# Altium schematic sheet 001_top.SchDoc
size A2; Organization: Greenfield Tech Solutions; Address1: Molendreef 33; Address2: Ossendrecht; Address3: 4641CS; Address4: The Netherlands; SheetNumber: 1; SheetTotal: 7
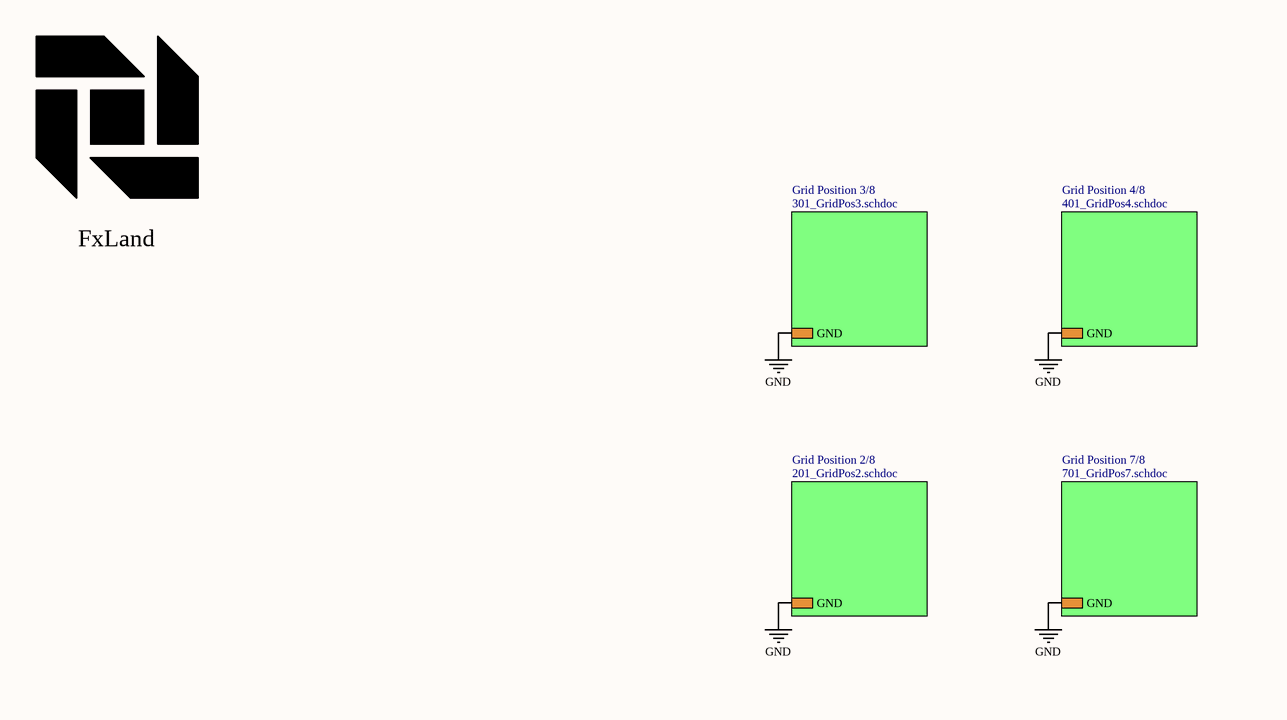
[diagram p0: 001_top.SchDoc, left]
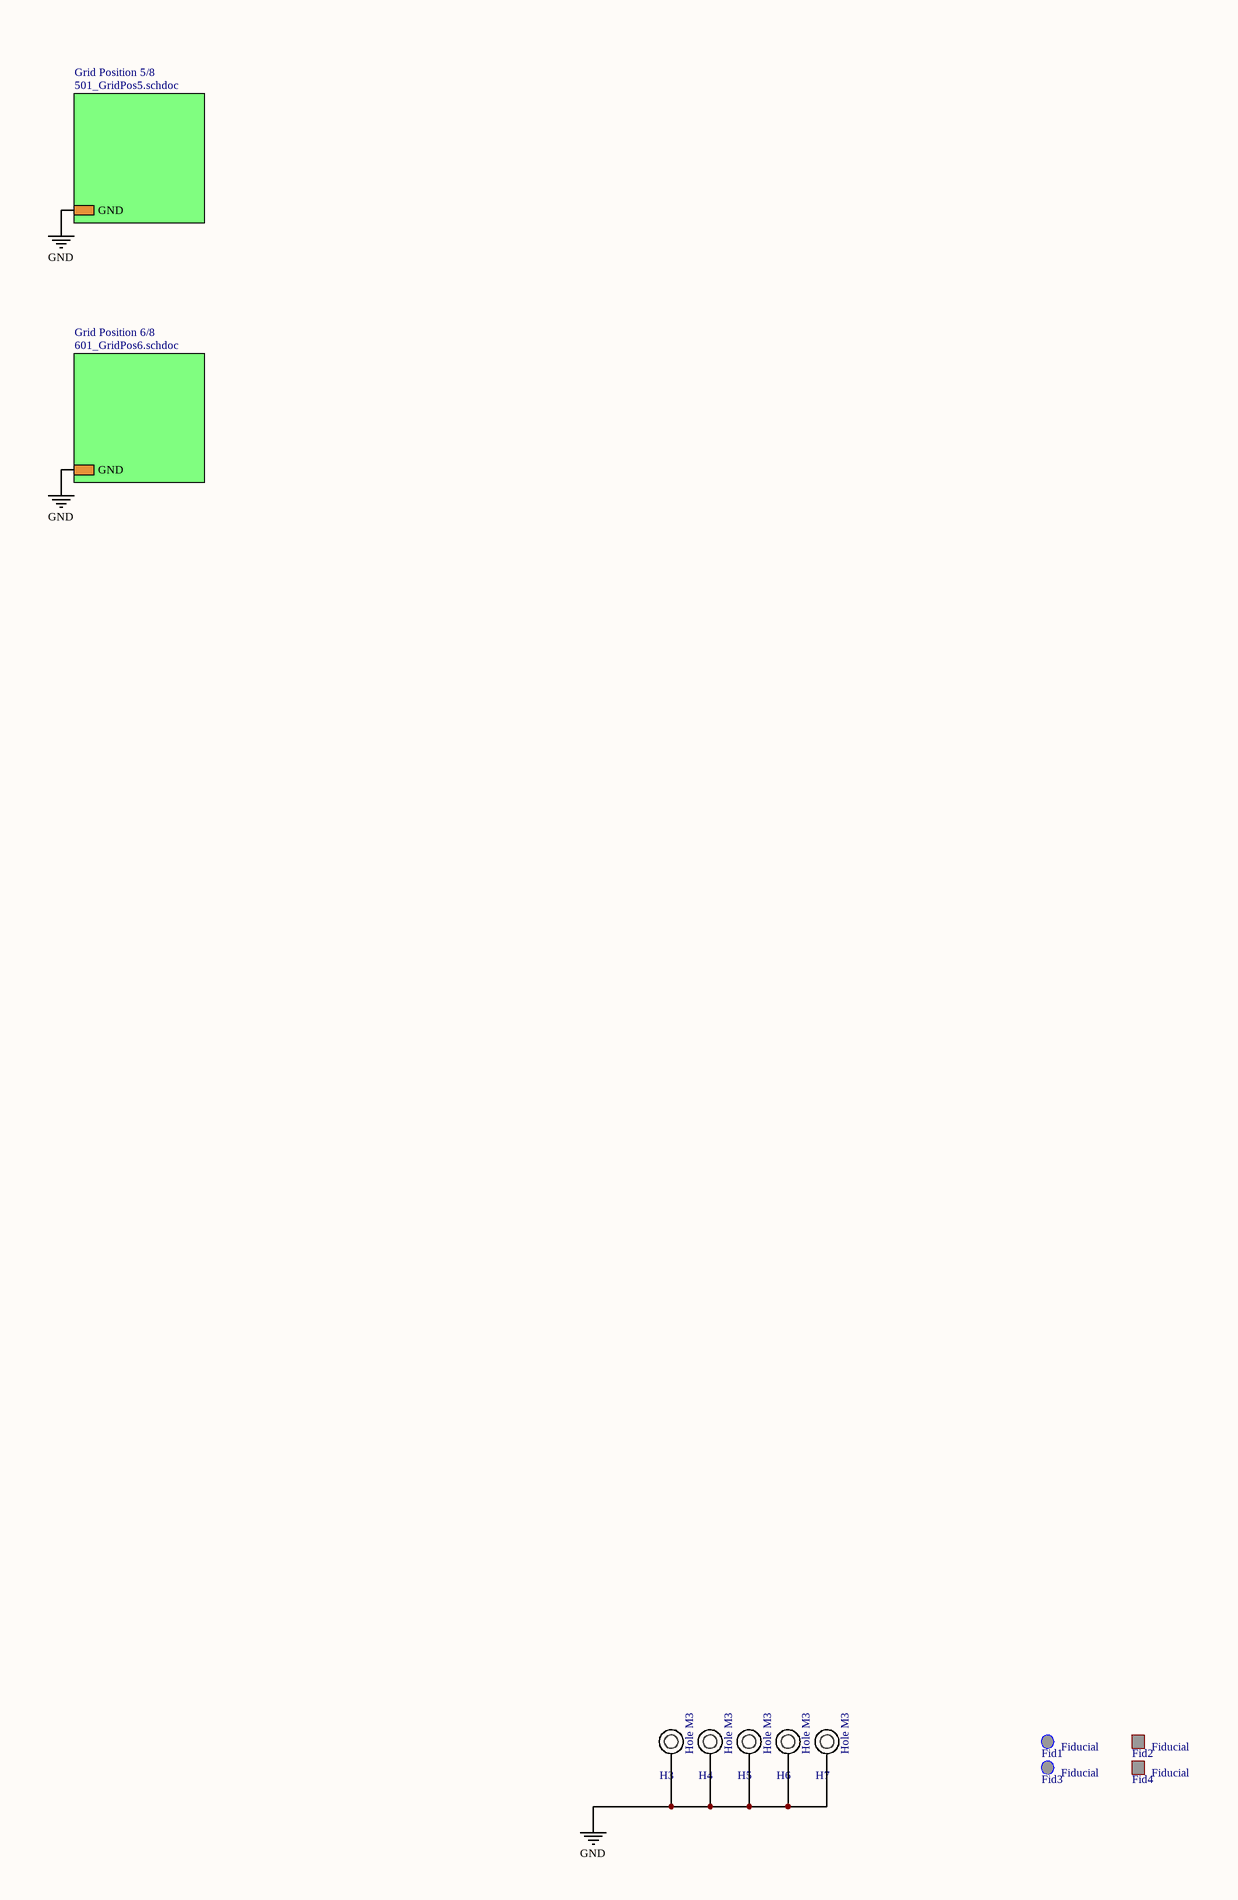
[diagram p1: 001_top.SchDoc, right]

## Parts
Fid1  Fiducial  [FidR_1.0mm]
Fid2  Fiducial  [FidS_1.0mm]
Fid3  Fiducial  [FidR_1.0mm]
Fid4  Fiducial  [FidS_1.0mm]
H3  Hole M3  [HOLE_M3]
H4  Hole M3  [HOLE_M3]
H5  Hole M3  [HOLE_M3]
H6  Hole M3  [HOLE_M3]
H7  Hole M3  [HOLE_M3]
Logo_FxLand?  FxLand  [Logo_FxLand_3]  (value not drawn)

## Sub-sheets
Grid Position 2/8 = 201_GridPos2.schdoc: GND
Grid Position 3/8 = 301_GridPos3.schdoc: GND
Grid Position 4/8 = 401_GridPos4.schdoc: GND
Grid Position 5/8 = 501_GridPos5.schdoc: GND
Grid Position 6/8 = 601_GridPos6.schdoc: GND
Grid Position 7/8 = 701_GridPos7.schdoc: GND

## Nets
GND: H3.1 H4.1 H5.1 H6.1 H7.1 ; sheet Grid Position 2/8/GND, sheet Grid Position 4/8/GND, sheet Grid Position 5/8/GND, sheet Grid Position 3/8/GND, sheet Grid Position 6/8/GND, sheet Grid Position 7/8/GND

## Notes on the sheet
- Title
- Size:
- Date:
- File:
- A2
- Number:
- Time:
- Revision:
- Sheet
- of

## Library data of the parts
Fid1 Fid3 = ME0011: Fiducial Round 1mm; Part Number: ME0011; ID: 11; RefVal: Fiducial
Fid2 Fid4 = ME0012: Fiducial Sqaure 1mm; Part Number: ME0012; ID: 12; RefVal: Fiducial
H3-H7 = ME0001: Mounting Hole M3; Part Number: ME0001; ID: 1; RefVal: Hole M3
Logo_FxLand? = ME0008: Logo FxLand 3; Part Number: ME0008; ID: 8; RefVal: FxLand